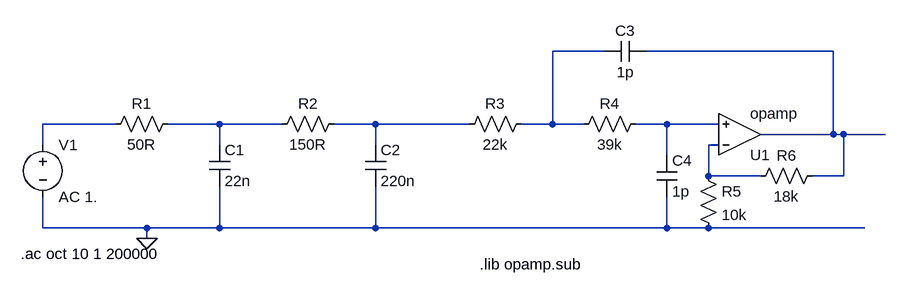
[diagram p0: schematic LoopFilter.asc]
LoopFilter.asc, the LTspice schematic file:
Version 4
SHEET 1 1236 680
WIRE 800 -160 720 -160
WIRE 1152 -160 864 -160
WIRE 48 -48 -64 -48
WIRE 208 -48 128 -48
WIRE 304 -48 208 -48
WIRE 448 -48 384 -48
WIRE 592 -48 448 -48
WIRE 720 -48 720 -160
WIRE 720 -48 672 -48
WIRE 768 -48 720 -48
WIRE 896 -48 848 -48
WIRE 976 -48 896 -48
WIRE 1152 -32 1152 -160
WIRE 1152 -32 1040 -32
WIRE 1168 -32 1152 -32
WIRE 1232 -32 1168 -32
WIRE -64 -16 -64 -48
WIRE 208 -16 208 -48
WIRE 448 -16 448 -48
WIRE 976 -16 960 -16
WIRE 896 0 896 -48
WIRE 960 32 960 -16
WIRE 1040 32 960 32
WIRE 1168 32 1168 -32
WIRE 1168 32 1120 32
WIRE -64 112 -64 64
WIRE 96 112 -64 112
WIRE 208 112 208 48
WIRE 208 112 96 112
WIRE 448 112 448 48
WIRE 448 112 208 112
WIRE 896 112 896 64
WIRE 896 112 448 112
WIRE 960 112 896 112
WIRE 1200 112 960 112
WIRE 96 128 96 112
FLAG 96 128 0
SYMBOL res 144 -64 R90
WINDOW 0 0 56 VBottom 2
WINDOW 3 32 56 VTop 2
SYMATTR InstName R1
SYMATTR Value 50R
SYMBOL res 400 -64 R90
WINDOW 0 0 56 VBottom 2
WINDOW 3 32 56 VTop 2
SYMATTR InstName R2
SYMATTR Value 150R
SYMBOL cap 192 -16 R0
SYMATTR InstName C1
SYMATTR Value 22n
SYMBOL cap 432 -16 R0
SYMATTR InstName C2
SYMATTR Value 220n
SYMBOL voltage -64 -32 R0
WINDOW 123 0 0 Left 0
WINDOW 39 0 0 Left 0
SYMATTR InstName V1
SYMATTR Value AC 1.
SYMBOL res 688 -64 R90
WINDOW 0 0 56 VBottom 2
WINDOW 3 32 56 VTop 2
SYMATTR InstName R3
SYMATTR Value 22k
SYMBOL res 864 -64 R90
WINDOW 0 0 56 VBottom 2
WINDOW 3 32 56 VTop 2
SYMATTR InstName R4
SYMATTR Value 39k
SYMBOL cap 864 -176 R90
WINDOW 0 0 32 VBottom 2
WINDOW 3 32 32 VTop 2
SYMATTR InstName C3
SYMATTR Value 1p
SYMBOL Opamps\\opamp 1008 32 M180
SYMATTR InstName U1
SYMBOL cap 880 0 R0
SYMATTR InstName C4
SYMATTR Value 1p
SYMBOL res 944 16 R0
SYMATTR InstName R5
SYMATTR Value 10k
SYMBOL res 1136 16 R90
WINDOW 0 0 56 VBottom 2
WINDOW 3 32 56 VTop 2
SYMATTR InstName R6
SYMATTR Value 18k
TEXT -98 152 Left 2 !.ac oct 10 1 200000
TEXT 608 168 Left 2 !.lib opamp.sub

The netlist it stands for:
* LoopFilter.asc
R1 N004 N003 50R
R2 N005 N004 150R
C1 N004 0 22n
C2 N005 0 220n
V1 N003 0 AC 1.
R3 N001 N005 22k
R4 N006 N001 39k
C3 N002 N001 1p
XU1 N007 N006 N002 opamp Aol=100K GBW=10Meg  ; pins invin noninvin out
C4 N006 0 1p
R5 N007 0 10k
R6 N002 N007 18k
.ac oct 10 1 200000
.lib opamp.sub
.backanno
.end